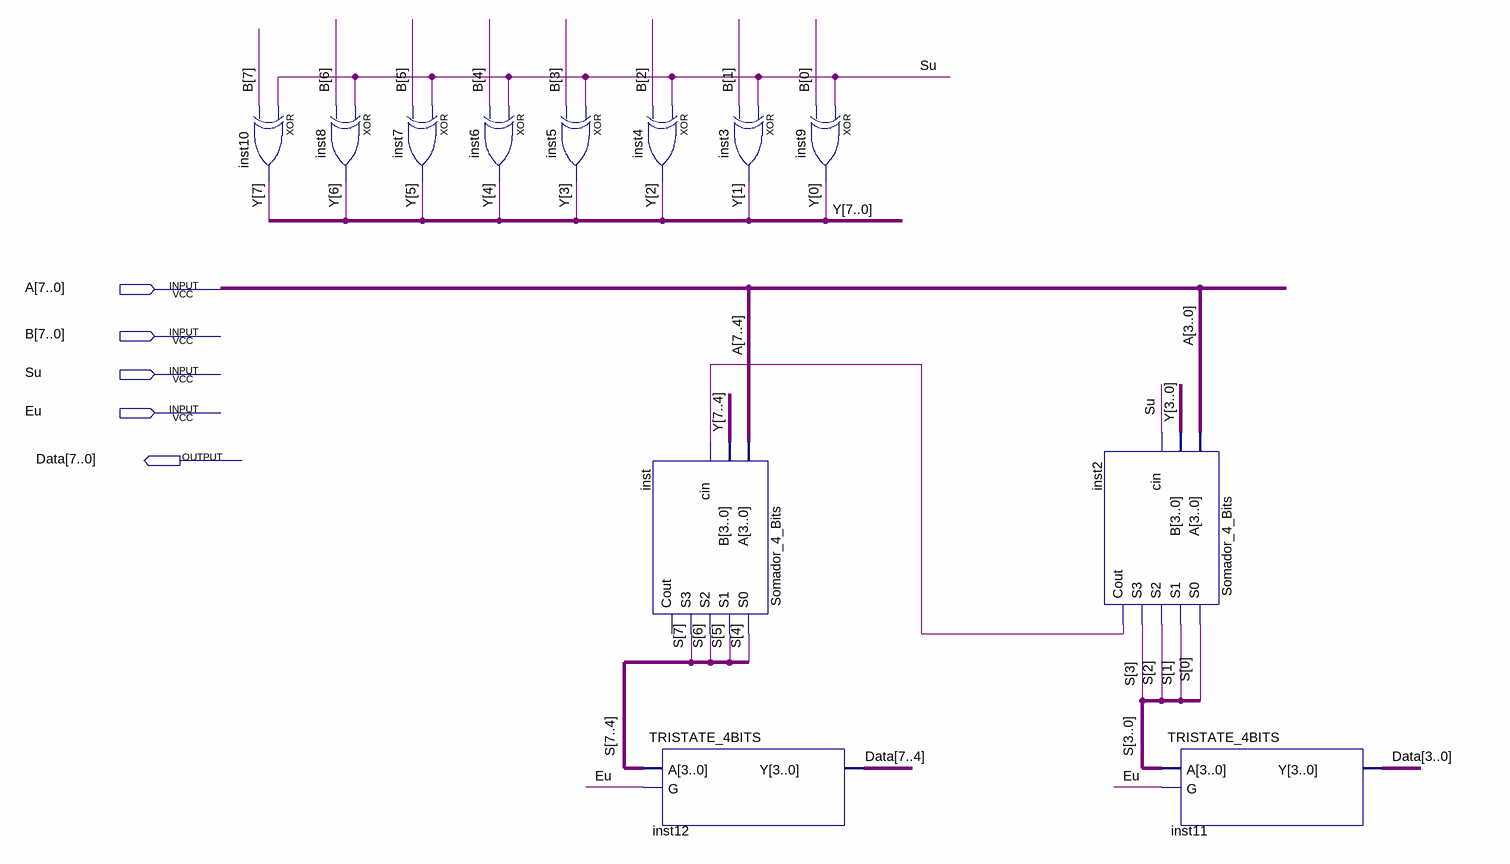
[diagram p0: schematic sheet]
// Quartus schematic Somador_Subtrator_8b.bdf as structural Verilog: 12 symbols, 5 pins
module Somador_Subtrator_8b (
  input  [7:0] A,
  input  [7:0] B,
  input  Su,
  input  Eu,
  output [7:0] Data
);

  wire inst2_cout;
  wire [7:0] S, Y;

  xor inst10 (Y[7], Su, B[7]);
  xor inst8 (Y[6], Su, B[6]);
  xor inst7 (Y[5], Su, B[5]);
  xor inst6 (Y[4], Su, B[4]);
  xor inst5 (Y[3], Su, B[3]);
  xor inst4 (Y[2], Su, B[2]);
  Somador_4_Bits inst (
    .A(A[7:4]), .B(Y[7:4]), .cin(inst2_cout), .S0(S[4]), .S1(S[5]), .S2(S[6]), .S3(S[7]));  // open: Cout
  TRISTATE_4BITS inst12 (.A(S[7:4]), .G(Eu), .Y(Data[7:4]));
  xor inst3 (Y[1], Su, B[1]);
  xor inst9 (Y[0], Su, B[0]);
  Somador_4_Bits inst2 (
    .A(A[3:0]), .B(Y[3:0]), .cin(Su), .S0(S[0]), .S1(S[1]), .S2(S[2]), .S3(S[3]), .Cout(inst2_cout));
  TRISTATE_4BITS inst11 (.A(S[3:0]), .G(Eu), .Y(Data[3:0]));
endmodule
